# Altium project Back.PrjPcb
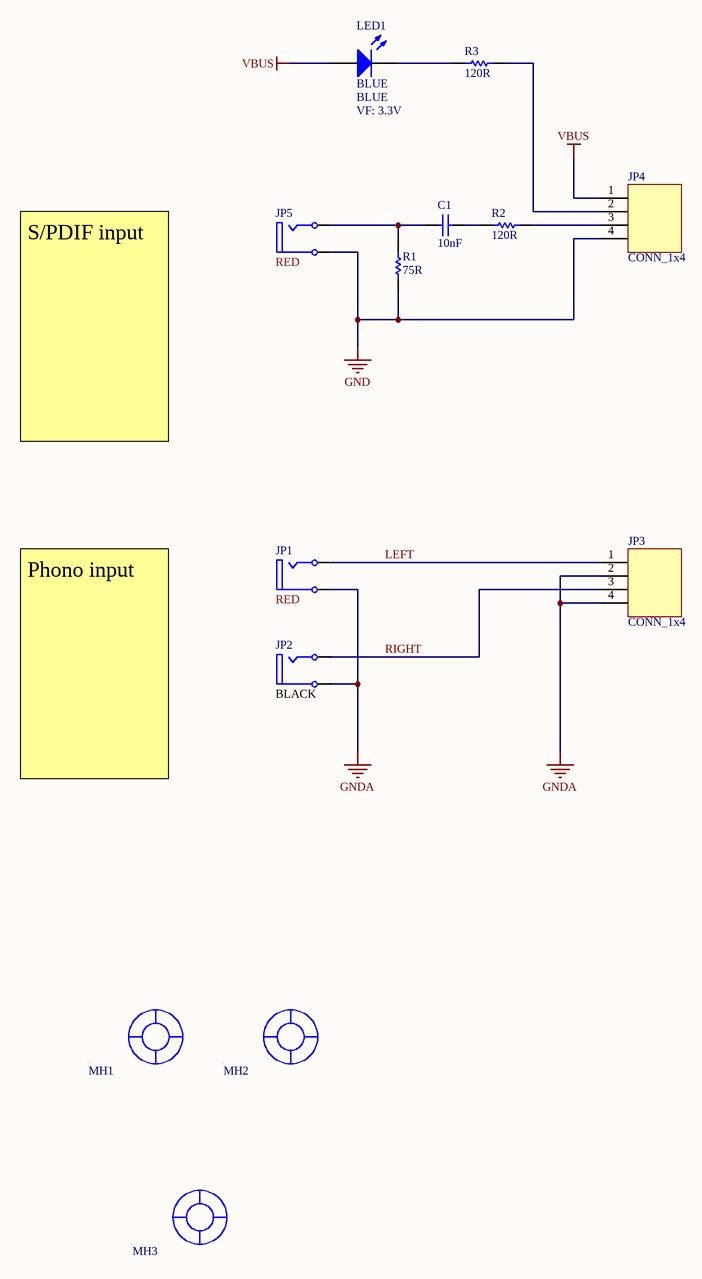
[diagram p0: Back.SchDoc]
1 sheet, 13 parts. Net scope: global (net labels, ports and power ports of the same name join across sheets).
Board file: Back.PcbDoc

## Sheet Back.SchDoc
size A3

### Parts
C1  value 10nF  [CAPC0805(2012)145_N]  (hidden comment: CAP 10nF 16V 0805(2012))
JP1  value RED  [CONN_RCA-Lumberg-BTOR]  (hidden comment: RCA RED)
JP2  value BLACK  [CONN_RCA-Lumberg-BTOR]  (hidden comment: RCA BLACK)
JP3  CONN_1x4  [CONN_HDR1X4-No3D]
JP4  CONN_1x4  [CONN_HDR1X4-No3D]
JP5  value RED  [CONN_RCA-Lumberg-BTOR]  (hidden comment: RCA RED)
LED1  BLUE  VF: 3.3V  [LED-KPTL-3216QBC]
MH1  Mounting hole  [MECH_MHOLE_3.5-GND]  (value not drawn)
MH2  Mounting hole  [MECH_MHOLE_3.5]  (value not drawn)
MH3  Mounting hole  [MECH_USB_MICRO_CUTOUT]  (value not drawn)
R1  value 75R  [RESC0805(2012)_M]  (hidden comment: 75R 1% 0805(2012))
R2  value 120R  [RESC0805(2012)_N]  (hidden comment: 120R 5% 0805(2012))
R3  value 120R  [RESC0805(2012)_N]  (hidden comment: 120R 5% 0805(2012))

### Nets
GND: JP4.4 JP5.2(Ground) R1.2
GNDA: JP1.2(Ground) JP2.2(Ground) JP3.2 JP3.4
VBUS: JP4.1 LED1.A
LEFT: JP1.1(Signal) JP3.1
RIGHT: JP2.1(Signal) JP3.3
NetC1_1: C1.1 R2.2
NetC1_2: C1.2 JP5.1(Signal) R1.1
NetJP4_2: JP4.2 R3.1
NetJP4_3: JP4.3 R2.1
NetLED1_K: LED1.K R3.2

### Notes on the sheet
- S/PDIF input
- Phono input

### Library data of the parts
C1 = CMP-1036-03822-1: CAP 10nF 16V ±20% 0805 (2012 Metric) Thickness 1.45mm SMD; Case-EIA: 0805; Case-Metric: 2012; Tolerance: Â±20%; Max Thickness: 1.45 mm; Rated Voltage: 16 V; Technology: SMT
JP1 JP5 = CONN_RCA_LUMBERG_BTOR_1_RED: RCA panel-mount socket red, 1553 02 rot, Lumberg Connect GmbH; MPN: BTOR 1 ROT; ELFA: 300-68-470; Farnell: 1368644
JP2 = CONN_RCA_LUMBERG_BTOR_1_BLACK: RCA panel-mount socket red, 1553 02 rot, Lumberg Connect GmbH; MPN: BTOR 1 SCHWARZ; ELFA: 300-68-471; Farnell: 1217030
JP3 JP4 = CONN_MHDR_1x4: Header, 4-Pin; MPN: 0470531000; LatestRevisionDate: 17-Jul-2002; LatestRevisionNote: Re-released for DXP Platform.; Publisher: Altium Limited; DigiKey: WM4330-ND
LED1 = LED-BLUE-KPTL-3216QBC-D-01: LED BLUE; MPN: KPTL-3216QBC-D-01; Farnell: 2217907; VALUE: BLUE
MH1 MH2 = MECH_MHOLE
MH3 = MECH_MICRO_B_CUTOUT
R1 = CMP-1013-00383-1: 75R 0.125W 1% 0805 (2012 Metric)  SMD; Case-EIA: 0805; Case-Metric: 2012; Technology: SMT; Tolerance: 1 %; Power: 0.125 W
R2 R3 = CMP-1013-00052-1: 120R 0.125W 5% 0805 (2012 Metric)  SMD; Case-Metric: 2012; Case-EIA: 0805; Tolerance: 5 %; Technology: SMT; Power: 0.125 W